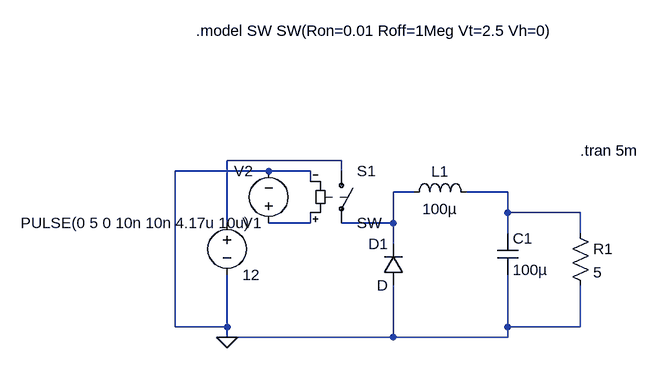
[diagram p0: schematic Buck_Converter.asc]
Buck_Converter.asc, the LTspice schematic file:
Version 4.1
SHEET 1 880 680
WIRE 208 48 32 48
WIRE 96 64 -48 64
WIRE 160 64 96 64
WIRE 208 64 208 48
WIRE 160 80 160 64
WIRE 320 96 288 96
WIRE 464 96 400 96
WIRE 464 128 464 96
WIRE 576 128 464 128
WIRE 32 144 32 48
WIRE 160 144 160 128
WIRE 160 144 96 144
WIRE 288 144 288 96
WIRE 288 144 208 144
WIRE 464 160 464 128
WIRE 576 160 576 128
WIRE 288 176 288 144
WIRE -48 304 -48 64
WIRE 32 304 32 224
WIRE 32 304 -48 304
WIRE 464 304 464 224
WIRE 576 304 576 240
WIRE 576 304 464 304
WIRE 32 320 32 304
WIRE 288 320 288 240
WIRE 288 320 32 320
WIRE 464 320 464 304
WIRE 464 320 288 320
FLAG 32 320 0
SYMBOL voltage 32 128 R0
WINDOW 123 0 0 Left 0
WINDOW 39 0 0 Left 0
SYMATTR InstName V1
SYMATTR Value 12
SYMBOL sw 208 48 R0
SYMATTR InstName S1
SYMBOL ind 304 112 R270
WINDOW 0 32 56 VTop 2
WINDOW 3 5 56 VBottom 2
SYMATTR InstName L1
SYMATTR Value 100µ
SYMATTR SpiceLine Rser=1m
SYMBOL cap 448 160 R0
SYMATTR InstName C1
SYMATTR Value 100µ
SYMBOL res 560 144 R0
SYMATTR InstName R1
SYMATTR Value 5
SYMBOL diode 304 240 R180
WINDOW 0 24 64 Left 2
WINDOW 3 24 0 Left 2
SYMATTR InstName D1
SYMBOL voltage 96 160 R180
WINDOW 0 24 96 Left 2
WINDOW 3 24 16 Left 2
WINDOW 123 0 0 Left 0
WINDOW 39 0 0 Left 0
SYMATTR InstName V2
SYMATTR Value PULSE(0 5 0 10n 10n 4.17u 10u)
TEXT -16 -152 Left 2 !.model SW SW(Ron=0.01 Roff=1Meg Vt=2.5 Vh=0)
TEXT 576 32 Left 2 !.tran 5m

The netlist it stands for:
* Buck_Converter.asc
V1 N001 0 12
S1 N001 N002 N004 0 SW
L1 N002 N003 100µ Rser=1m
C1 N003 0 100µ
R1 N003 0 5
D1 0 N002 D
V2 N004 0 PULSE(0 5 0 10n 10n 4.17u 10u)
.model D D
.lib standard.dio
.model SW SW(Ron=0.01 Roff=1Meg Vt=2.5 Vh=0)
.tran 5m
.backanno
.end